# EAGLE schematic usbB_isp (EAGLE 6.4)
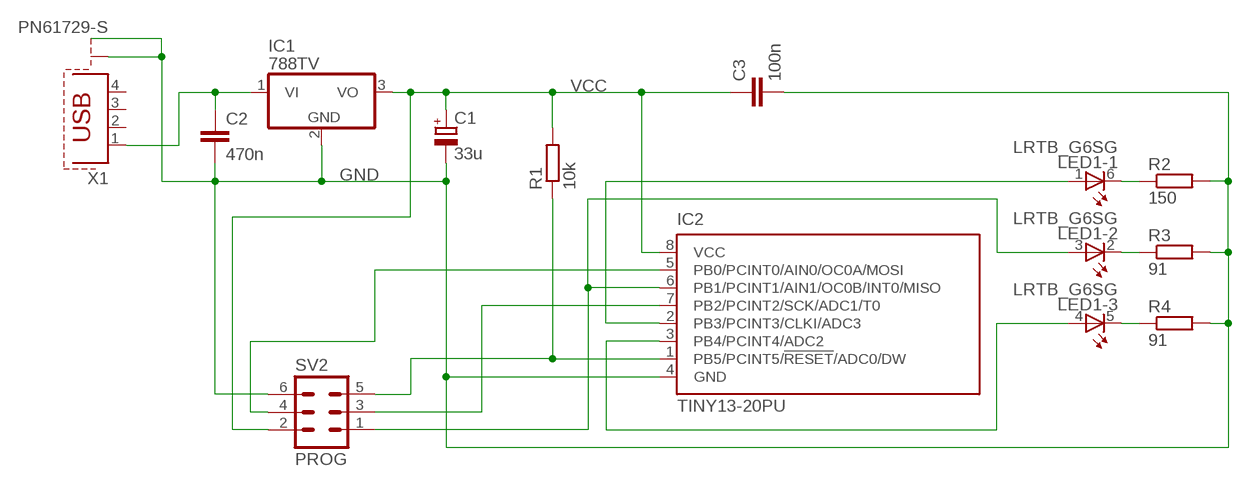
[diagram p0: schematic, sheet 1]

## Parts
C1  33u  CPOL-EUE2,5-6E  [E2,5-6E]
C2  470n  C-EU050-025X075  [C050-025X075]
C3  100n  C-EU050-025X075  [C050-025X075]
IC1  788TV  [TO220V]
IC2  TINY13-20PU  [DIL08]
LED1  LRTB_G6SG  [LRTB_G6SG]
R1  10k  R-EU_0204/7  [0204/7]
R2  150  R-EU_0204/7  [0204/7]
R3  91  R-EU_0204/7  [0204/7]
R4  91  R-EU_0204/7  [0204/7]
SV2  PROG  ML6  [ML6]
X1  PN61729-S  [PN61729-S]

## Nets
_RESET: IC2.1(PB5/PCINT5/!RESET!/ADC0/DW) R1.1 SV2.5
GND: C1.- C2.2 C3.2 IC1.2(GND) IC2.4(GND) R2.2 R3.2 R4.2 SV2.6 X1.S1
MISO: IC2.6(PB1/PCINT1/AIN1/OC0B/INT0/MISO) LED1.3(-2:A) SV2.1
N$1: C2.1 IC1.1(VI) X1.1
N$3: IC2.2(PB3/PCINT3/CLKI/ADC3) LED1.1(-1:A)
N$6: LED1.5(-3:C) R4.1
N$7: LED1.2(-2:C) R3.1
N$8: LED1.6(-1:C) R2.1
N$9: IC2.3(PB4/PCINT4/ADC2) LED1.4(-3:A)
N$10: IC2.5(PB0/PCINT0/AIN0/OC0A/MOSI) SV2.4
SCK: IC2.7(PB2/PCINT2/SCK/ADC1/T0) SV2.3
VCC: C1.+ C3.1 IC1.3(VO) IC2.8(VCC) R1.2 SV2.2
Unconnected: X1.2 X1.3 X1.4 X1.S2

## Library data of the parts
C1 = rcl:CPOL-EU: POLARIZED CAPACITOR, European symbol
C2 C3 = rcl:C-EU: CAPACITOR, European symbol
IC1 = linear:78*: Positive VOLTAGE REGULATOR Source: http://cache.national.com/ds/LM/LM78L05.pdf http://www.fairchildsemi.com/ds/LM/LM7805.pdf
IC2 = atmel:TINY13: 8-bit AVR Microcontroller with 1K Bytes In-System Programmable Flash Source: http://www.atmel.com/dyn/resources/prod_documents/2535S.pdf; MPN: ATTINY13-20PU; OC_FARNELL: 9171550; OC_NEWARK: 96K6521
LED1 = led:LRTB_G6SG: LRTB G6SG 6-lead TOPLED® Source: OSRAM Opto Semiconductors ... LRTB_G6SG_Pb_free.pdf
R1-R4 = resistor:R-EU_: RESISTOR, European symbol
SV2 = con-ml:ML6: HARTING; OC_FARNELL: unknown; OC_NEWARK: unknown
X1 = con-berg:PN61729-S: BERG USB connector; OC_FARNELL: unknown; OC_NEWARK: unknown

## Net classes
0 default: clearance 0.355 mm